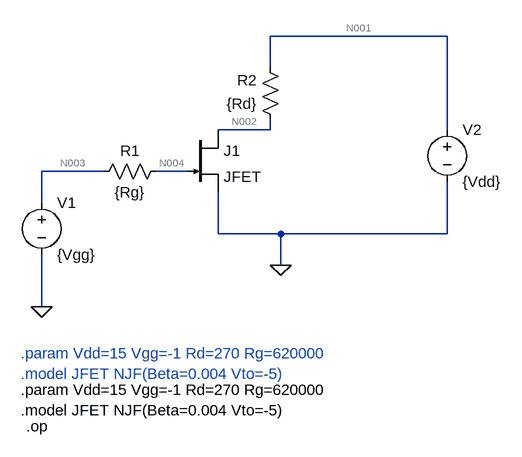
[diagram p0: schematic Q7-1.asc]
Q7-1.asc, the LTspice schematic file:
Version 4
SHEET 1 884 680
WIRE 784 -160 512 -160
WIRE 512 -112 512 -160
WIRE 512 -16 512 -32
WIRE 512 -16 432 -16
WIRE 784 -16 784 -160
WIRE 256 48 160 48
WIRE 384 48 336 48
WIRE 160 96 160 48
WIRE 432 144 432 80
WIRE 528 144 432 144
WIRE 784 144 784 64
WIRE 784 144 528 144
WIRE 528 192 528 144
WIRE 160 256 160 176
FLAG 160 256 0
FLAG 528 192 0
SYMBOL voltage 160 80 R0
SYMATTR InstName V1
SYMATTR Value {Vgg}
SYMBOL voltage 784 -32 R0
SYMATTR InstName V2
SYMATTR Value {Vdd}
SYMBOL res 352 32 R90
WINDOW 0 0 56 VBottom 2
WINDOW 3 32 56 VTop 2
SYMATTR InstName R1
SYMATTR Value {Rg}
SYMBOL res 528 -16 R180
WINDOW 0 36 76 Left 2
WINDOW 3 36 40 Left 2
SYMATTR InstName R2
SYMATTR Value {Rd}
SYMBOL njf 384 -16 R0
SYMATTR InstName J1
SYMATTR Value JFET
TEXT 128 328 Left 2 ;.param Vdd=15 Vgg=-1 Rd=270 Rg=620000\n.model JFET NJF(Beta=0.004 Vto=-5)
TEXT 128 384 Left 2 !.param Vdd=15 Vgg=-1 Rd=270 Rg=620000\n.model JFET NJF(Beta=0.004 Vto=-5)
TEXT 136 440 Left 2 !.op

The netlist it stands for:
* Q7-1.asc
V1 N003 0 {Vgg}
V2 N001 0 {Vdd}
R1 N004 N003 {Rg}
R2 N002 N001 {Rd}
J1 N002 N004 0 JFET
.model NJF NJF
.model PJF PJF
.lib standard.jft
* .param Vdd=15 Vgg=-1 Rd=270 Rg=620000
* .model JFET NJF(Beta=0.004 Vto=-5)
.param Vdd=15 Vgg=-1 Rd=270 Rg=620000
.model JFET NJF(Beta=0.004 Vto=-5)
.op
.backanno
.end

* Results of the author's LTspice run, read from the files saved beside the schematic
* Operating Point:
*   V(n003) = -1 V
*   V(n001) = 15 V
*   V(n004) = -1 V
*   V(n002) = 2.008 V
*   Id(J1) = 48.12 mA
*   Ig(J1) = -4.028 pA
*   Is(J1) = -48.12 mA
*   I(R2) = -48.12 mA
*   I(R1) = 4.028 pA
*   I(V2) = -48.12 mA
*   I(V1) = 4.028 pA
* From the log:
*   Semiconductor Device Operating Points:
*                           --- JFET Transistors ---
*   Name:      j1
*   Model:    jfet
*   Id:      4.81e-02
*   Vgs:    -1.00e+00
*   Vds:     2.01e+00
*   Gm:      1.61e-02
*   Gds:     1.59e-02
*   Cgs:     0.00e+00
*   Cgd:     0.00e+00